# Altium project Control_Devices.PrjPcb (part 1 of 3)
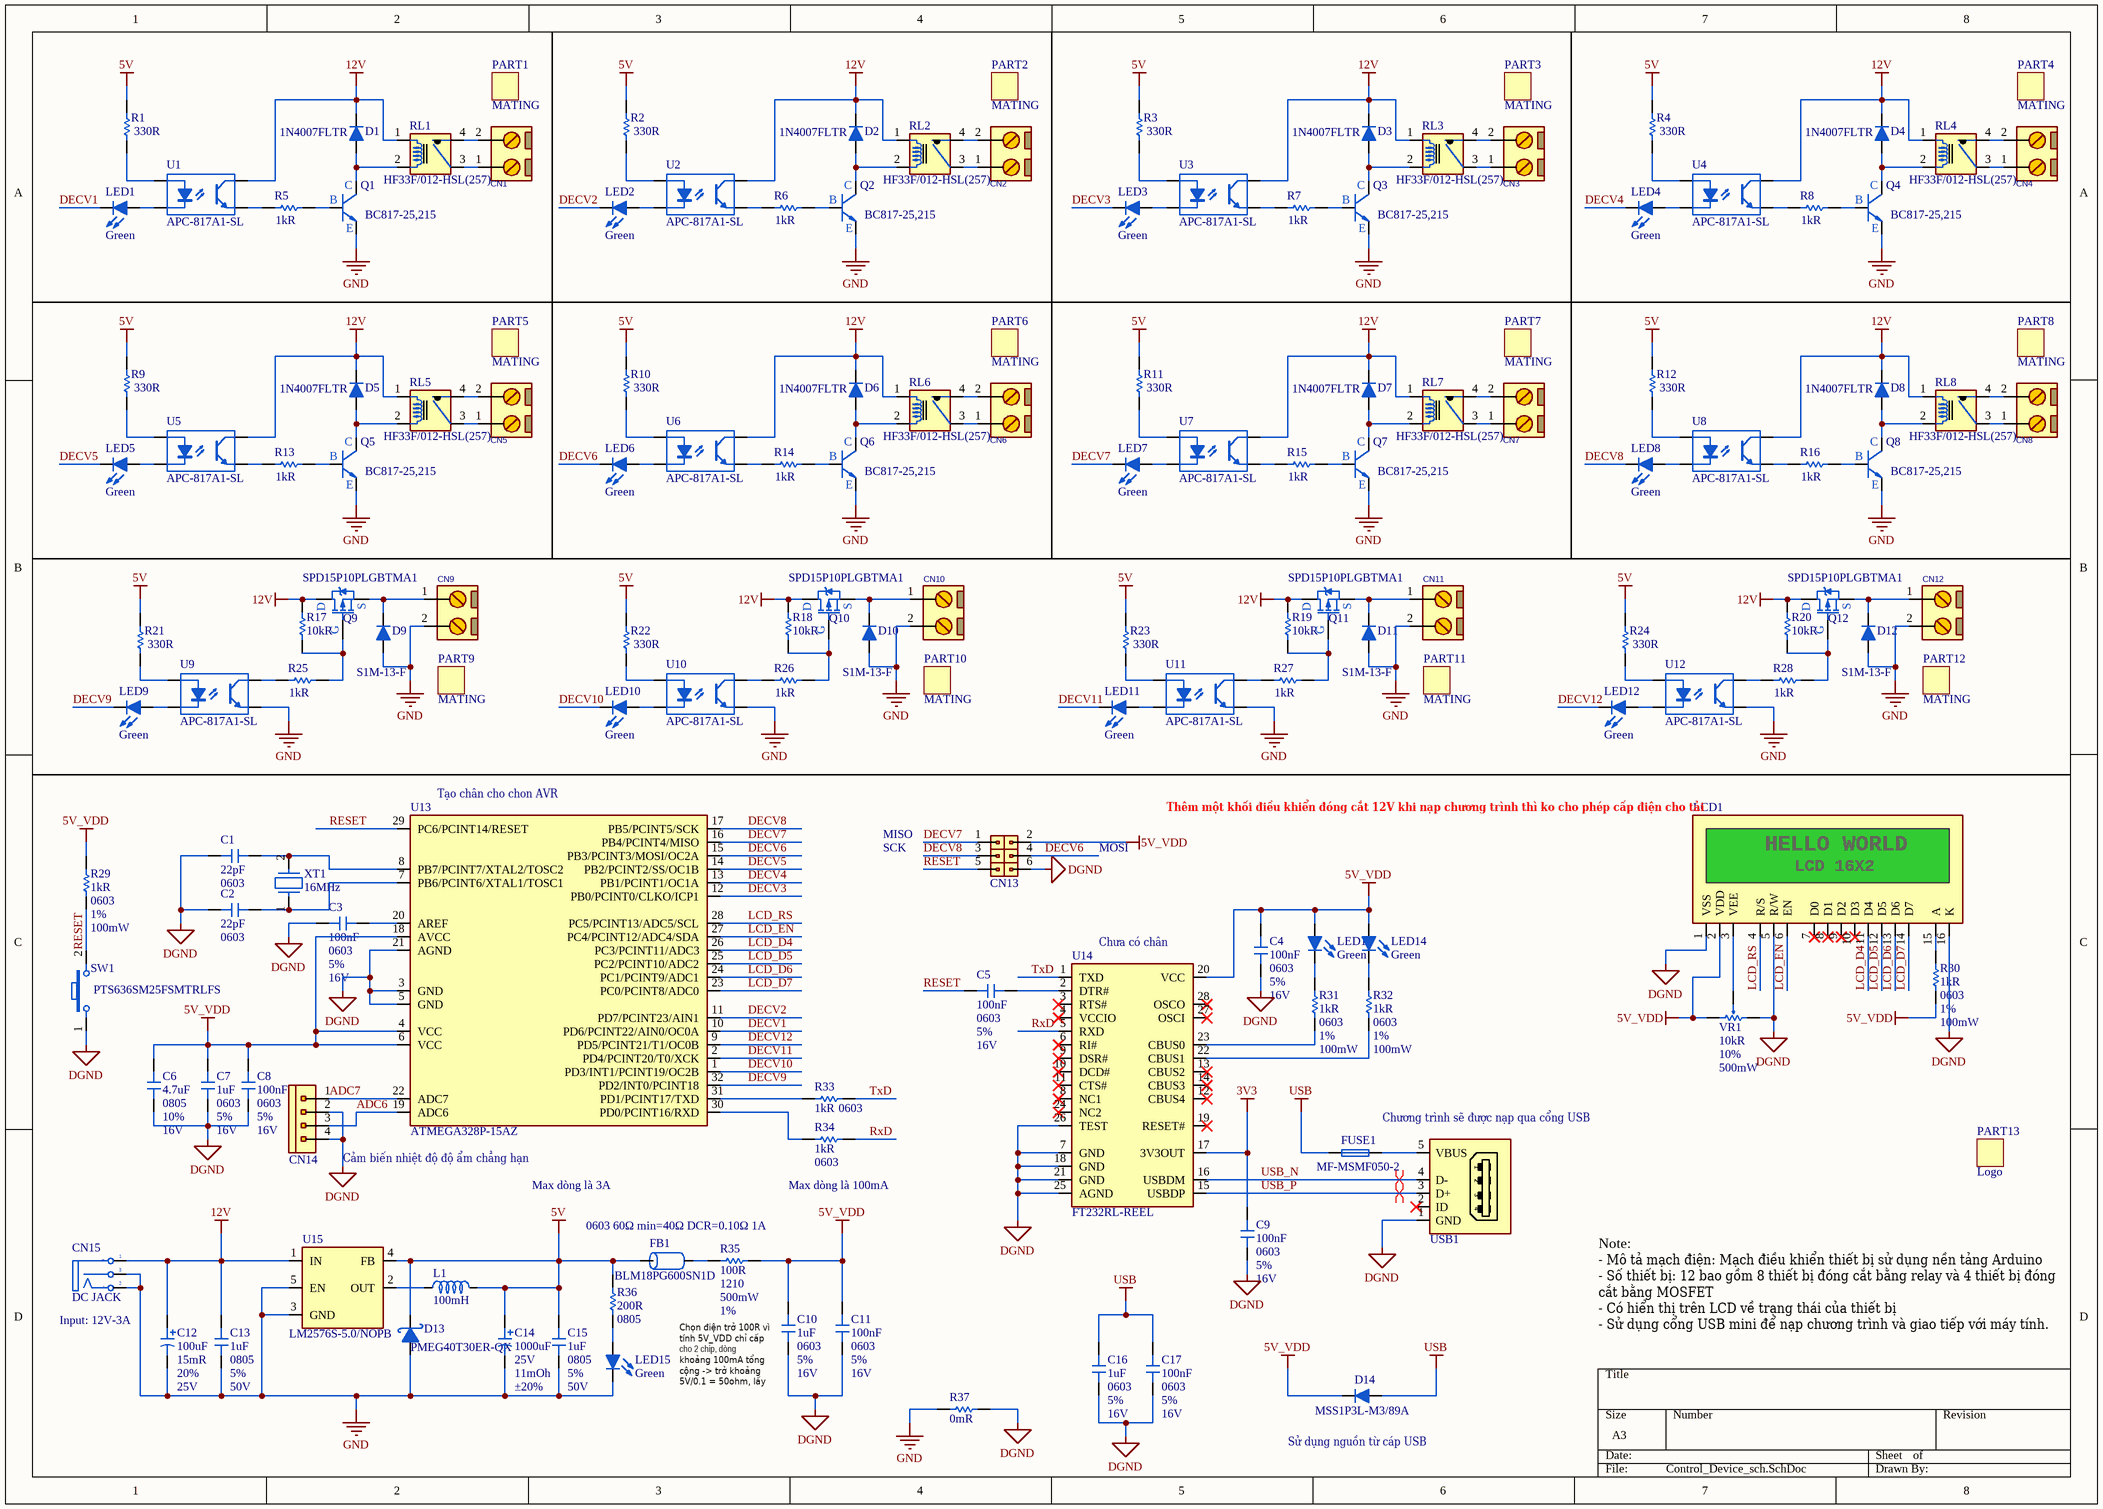
[diagram p0: Control_Device_sch.SchDoc]
1 sheet, 154 parts. Net scope: global (net labels, ports and power ports of the same name join across sheets).
Board file: Control_Device.PcbDoc

## Sheet Control_Device_sch.SchDoc
size A3

### Parts
C1  22pF  Case/Package: 0603  [C0603E]
C2  22pF  Case/Package: 0603  [C0603E]
C3  100nF  Case/Package: 0603  Tolerance: 5%  Voltage Rating: 16V  [C0603E]
C4  100nF  Case/Package: 0603  Tolerance: 5%  Voltage Rating: 16V  [C0603E]
C5  100nF  Case/Package: 0603  Tolerance: 5%  Voltage Rating: 16V  [C0603E]
C6  4.7uF  Case/Package: 0805  Tolerance: 10%  Voltage Rating: 16V  [C0603E]
C7  1uF  Case/Package: 0603  Tolerance: 5%  Voltage Rating: 16V  [C0603E]
C8  100nF  Case/Package: 0603  Tolerance: 5%  Voltage Rating: 16V  [C0603E]
C9  100nF  Case/Package: 0603  Tolerance: 5%  Voltage Rating: 16V  [C0603E]
C10  1uF  Case/Package: 0603  Tolerance: 5%  Voltage Rating: 16V  [C0603E]
C11  100nF  Case/Package: 0603  Tolerance: 5%  Voltage Rating: 16V  [C0603E]
C12  100uF  ESR (Equivalent Series Resistance): 15mR  Tolerance: 20%  Voltage Rating: 25V  [CAP_ELEC_500_12X25_THD]
C13  1uF  Case/Package: 0805  Tolerance: 5%  Voltage Rating: 50V  [C0805E]
C14  1000uF  Voltage: 25V  ERS: 11mOh  Tolerance: ±20%  [CAP_ELEC_500_10X16_THD]
C15  1uF  Case/Package: 0805  Tolerance: 5%  Voltage Rating: 50V  [C0805E]
C16  1uF  Case/Package: 0603  Tolerance: 5%  Voltage Rating: 16V  [C0603E]
C17  100nF  Case/Package: 0603  Tolerance: 5%  Voltage Rating: 16V  [C0603E]
CN1  (no value)  [CON_PWR_508_H_2P]
CN2  (no value)  [CON_PWR_508_H_2P]
CN3  (no value)  [CON_PWR_508_H_2P]
CN4  (no value)  [CON_PWR_508_H_2P]
CN5  (no value)  [CON_PWR_508_H_2P]
CN6  (no value)  [CON_PWR_508_H_2P]
CN7  (no value)  [CON_PWR_508_H_2P]
CN8  (no value)  [CON_PWR_508_H_2P]
CN9  (no value)  [CON_PWR_508_H_2P]
CN10  (no value)  [CON_PWR_508_H_2P]
CN11  (no value)  [CON_PWR_508_H_2P]
CN12  (no value)  [CON_PWR_508_H_2P]
CN13  PEC03DAAN  [CON_JPR_254_M_2X3]  (value not drawn)
CN14  (no value)  [CON_JPR_254_M_1X4]
CN15  DC JACK  [JAC_DC_2MM_THD]
D1  1N4007FLTR  [D1206_SOD123_DO213AA]
D2  1N4007FLTR  [D1206_SOD123_DO213AA]
D3  1N4007FLTR  [D1206_SOD123_DO213AA]
D4  1N4007FLTR  [D1206_SOD123_DO213AA]
D5  1N4007FLTR  [D1206_SOD123_DO213AA]
D6  1N4007FLTR  [D1206_SOD123_DO213AA]
D7  1N4007FLTR  [D1206_SOD123_DO213AA]
D8  1N4007FLTR  [D1206_SOD123_DO213AA]
D9  S1M-13-F  [DIODE_SMA]
D10  S1M-13-F  [DIODE_SMA]
D11  S1M-13-F  [DIODE_SMA]
D12  S1M-13-F  [DIODE_SMA]
D13  PMEG40T30ER-QX  [DIODE_SOD123W]
D14  MSS1P3L-M3/89A  [DIODE_S457]
FB1  BLM18PG600SN1D  [IND_L0603E_1608]
FUSE1  MF-MSMF050-2  [RFUSE]
L1  100mH  [L_12X12]
LCD1  (no value)  [LCD_16x2]
LED1  Green  [LED0603]
LED2  Green  [LED0603]
LED3  Green  [LED0603]
LED4  Green  [LED0603]
LED5  Green  [LED0603]
LED6  Green  [LED0603]
LED7  Green  [LED0603]
LED8  Green  [LED0603]
LED9  Green  [LED0603]
LED10  Green  [LED0603]
LED11  Green  [LED0603]
LED12  Green  [LED0603]
LED13  Green  [LED0603]
LED14  Green  [LED0603]
LED15  Green  [LED0603]
PART1  MATING  (no BOM)
PART2  MATING  (no BOM)
PART3  MATING  (no BOM)
PART4  MATING  (no BOM)
PART5  MATING  (no BOM)
PART6  MATING  (no BOM)
PART7  MATING  (no BOM)
PART8  MATING  (no BOM)
PART9  MATING  (no BOM)
PART10  MATING  (no BOM)
PART11  MATING  (no BOM)
PART12  MATING  (no BOM)
PART13  Logo  [MyLogo_5mm - Invert]  (no BOM)
Q1  BC817-25,215  [SOT23_3]
Q2  BC817-25,215  [SOT23_3]
Q3  BC817-25,215  [SOT23_3]
Q4  BC817-25,215  [SOT23_3]
Q5  BC817-25,215  [SOT23_3]
Q6  BC817-25,215  [SOT23_3]
Q7  BC817-25,215  [SOT23_3]
Q8  BC817-25,215  [SOT23_3]
Q9  SPD15P10PLGBTMA1  [DPAK3_TO-252]
Q10  SPD15P10PLGBTMA1  [DPAK3_TO-252]
Q11  SPD15P10PLGBTMA1  [DPAK3_TO-252]
Q12  SPD15P10PLGBTMA1  [DPAK3_TO-252]
R1  330R  [R0603E]
R2  330R  [R0603E]
R3  330R  [R0603E]
R4  330R  [R0603E]
R5  1kR  [R0603E]
R6  1kR  [R0603E]
R7  1kR  [R0603E]
R8  1kR  [R0603E]
R9  330R  [R0603E]
R10  330R  [R0603E]
R11  330R  [R0603E]
R12  330R  [R0603E]
R13  1kR  [R0603E]
R14  1kR  [R0603E]
R15  1kR  [R0603E]
R16  1kR  [R0603E]
R17  10kR  [R0603E]
R18  10kR  [R0603E]
R19  10kR  [R0603E]
R20  10kR  [R0603E]
R21  330R  [R0603E]
R22  330R  [R0603E]
R23  330R  [R0603E]
R24  330R  [R0603E]
R25  1kR  [R0603E]
R26  1kR  [R0603E]
R27  1kR  [R0603E]
R28  1kR  [R0603E]
R29  1kR  Case/Package: 0603  Tolerance: 1%  Max Power Dissipation: 100mW  [R0603E]
R30  1kR  Case/Package: 0603  Tolerance: 1%  Max Power Dissipation: 100mW  [R0603E]
R31  1kR  Case/Package: 0603  Tolerance: 1%  Max Power Dissipation: 100mW  [R0603E]
R32  1kR  Case/Package: 0603  Tolerance: 1%  Max Power Dissipation: 100mW  [R0603E]
R33  1kR  Case/Package: 0603  [R0603E]
R34  1kR  Case/Package: 0603  [R0603E]
R35  100R  Case/Package: 1210  Power Rating: 500mW  Tolerance: 1%  [R1210]
R36  200R  Case/Package: 0805  [R0805E]
R37  0mR  [R1210]
RL1  HF33F/012-HSL(257)  [RELAY_HF33F-Form-A]
RL2  HF33F/012-HSL(257)  [RELAY_HF33F-Form-A]
RL3  HF33F/012-HSL(257)  [RELAY_HF33F-Form-A]
RL4  HF33F/012-HSL(257)  [RELAY_HF33F-Form-A]
RL5  HF33F/012-HSL(257)  [RELAY_HF33F-Form-A]
RL6  HF33F/012-HSL(257)  [RELAY_HF33F-Form-A]
RL7  HF33F/012-HSL(257)  [RELAY_HF33F-Form-A]
RL8  HF33F/012-HSL(257)  [RELAY_HF33F-Form-A]
SW1  PTS636SM25FSMTRLFS  [SW2-SMD]
U1  APC-817A1-SL  [SO_4]
U2  APC-817A1-SL  [SO_4]
U3  APC-817A1-SL  [SO_4]
U4  APC-817A1-SL  [SO_4]
U5  APC-817A1-SL  [SO_4]
U6  APC-817A1-SL  [SO_4]
U7  APC-817A1-SL  [SO_4]
U8  APC-817A1-SL  [SO_4]
U9  APC-817A1-SL  [SO_4]
U10  APC-817A1-SL  [SO_4]
U11  APC-817A1-SL  [SO_4]
U12  APC-817A1-SL  [SO_4]
U13  ATMEGA328P-15AZ  [TQFP80P900X900X120-32N]
U14  FT232RL-REEL  [SOP65P780X200-28N]
U15  LM2576S-5.0/NOPB  [D2PAK_5P]
USB1  CONN_USB_MICROB  [USB_MICRO_B_BM_SHT2]  (value not drawn)
VR1  10kR  Tolerance: 10%  Power Rating: 500mW  [POT_3362H]
XT1  16MHz  [XT_2P_THD]

### Nets
3V3: C9.2 U14.17(3V3OUT)
5V: C14.1 C15.2 D13.2(K) FB1.1 L1.2 R1.2 R2.2 R3.2 R4.2 R9.2 R10.2 R11.2 R12.2 R21.2 R22.2 R23.2 R24.2 R36.2 U15.4(FB)
5V_VDD: C4.2 C6.2 C7.2 C8.1 C10.2 C11.2 CN13.2 D14.2(K) LCD1.2(VDD) LED13.1(A) LED14.1(A) R29.2 R30.2 R35.1 U13.4(VCC) U13.6(VCC) U13.18(AVCC) U14.20(VCC) VR1.1
12V: C12.1 C13.2 CN15.1(T) D1.2(K) D2.2(K) D3.2(K) D4.2(K) D5.2(K) D6.2(K) D7.2(K) D8.2(K) Q9.2(D) Q10.2(D) Q11.2(D) Q12.2(D) R17.2 R18.2 R19.2 R20.2 RL1.1 RL2.1 RL3.1 RL4.1 RL5.1 RL6.1 RL7.1 RL8.1 U1.4(C) U2.4(C) U3.4(C) U4.4(C) U5.4(C) U6.4(C) U7.4(C) U8.4(C) U15.1(IN)
DGND: C1.2 C2.2 C3.2 C4.1 C6.1 C7.1 C8.2 C9.1 C10.1 C11.1 C16.1 C17.1 CN13.6 CN14.2 CN14.4 LCD1.1(VSS) LCD1.5(R/W) LCD1.16(K) R37.1 SW1.1 U13.3(GND) U13.5(GND) U13.21(AGND) U14.7(GND) U14.18(GND) U14.21(GND) U14.25(AGND) U14.26(TEST) USB1.1(GND) VR1.3
GND: C12.2 C13.1 C14.2 C15.1 CN9.2 CN10.2 CN11.2 CN12.2 CN15.2(TN) CN15.3(S) D9.1(A) D10.1(A) D11.1(A) D12.1(A) D13.1(A) LED15.2(K) Q1.2(E) Q2.2(E) Q3.2(E) Q4.2(E) Q5.2(E) Q6.2(E) Q7.2(E) Q8.2(E) R37.2 U9.3(E) U10.3(E) U11.3(E) U12.3(E) U15.3(GND) U15.5(EN)
USB: C16.2 C17.2 D14.1(A) FUSE1.1
ADC6: CN14.3 U13.19(ADC6)
ADC7: CN14.1 U13.22(ADC7)
DECV1: LED1.2(K) U13.10(PD6/PCINT22/AIN0/OC0A)
DECV2: LED2.2(K) U13.11(PD7/PCINT23/AIN1)
DECV3: LED3.2(K) U13.12(PB0/PCINT0/CLKO/ICP1)
DECV4: LED4.2(K) U13.13(PB1/PCINT1/OC1A)
DECV5: LED5.2(K) U13.14(PB2/PCINT2/SS/OC1B)
DECV6: CN13.4 LED6.2(K) U13.15(PB3/PCINT3/MOSI/OC2A)
DECV7: CN13.1 LED7.2(K) U13.16(PB4/PCINT4/MISO)
DECV8: CN13.3 LED8.2(K) U13.17(PB5/PCINT5/SCK)
DECV9: LED9.2(K) U13.32(PD2/INT0/PCINT18)
DECV10: LED10.2(K) U13.1(PD3/INT1/PCINT19/OC2B)
DECV11: LED11.2(K) U13.2(PD4/PCINT20/T0/XCK)
DECV12: LED12.2(K) U13.9(PD5/PCINT21/T1/OC0B)
LCD_D4: LCD1.11(D4) U13.26(PC3/PCINT11/ADC3)
LCD_D5: LCD1.12(D5) U13.25(PC2/PCINT10/ADC2)
LCD_D6: LCD1.13(D6) U13.24(PC1/PCINT9/ADC1)
LCD_D7: LCD1.14(D7) U13.23(PC0/PCINT8/ADC0)
LCD_EN: LCD1.6(EN) U13.27(PC4/PCINT12/ADC4/SDA)
LCD_RS: LCD1.4(R/S) U13.28(PC5/PCINT13/ADC5/SCL)
RESET: C5.2 CN13.5 R29.1 SW1.2 U13.29(PC6/PCINT14/RESET)
RxD: R34.1 U14.5(RXD)
TxD: R33.1 U14.1(TXD)
USB_N: U14.16(USBDM) USB1.4(D-)
USB_P: U14.15(USBDP) USB1.3(D+)
NetC1_1: C1.1 U13.8(PB7/PCINT7/XTAL2/TOSC2) XT1.2
NetC2_1: C2.1 U13.7(PB6/PCINT6/XTAL1/TOSC1) XT1.1
NetC3_1: C3.1 U13.20(AREF)
NetC5_1: C5.1 U14.2(DTR#)
NetCN1_1: CN1.1 RL1.3
NetCN1_2: CN1.2 RL1.4
NetCN2_1: CN2.1 RL2.3
NetCN2_2: CN2.2 RL2.4
NetCN3_1: CN3.1 RL3.3
NetCN3_2: CN3.2 RL3.4
NetCN4_1: CN4.1 RL4.3
NetCN4_2: CN4.2 RL4.4
NetCN5_1: CN5.1 RL5.3
NetCN5_2: CN5.2 RL5.4
NetCN6_1: CN6.1 RL6.3
NetCN6_2: CN6.2 RL6.4
NetCN7_1: CN7.1 RL7.3
NetCN7_2: CN7.2 RL7.4
NetCN8_1: CN8.1 RL8.3
NetCN8_2: CN8.2 RL8.4
NetCN9_1: CN9.1 D9.2(K) Q9.3(S)
NetCN10_1: CN10.1 D10.2(K) Q10.3(S)
NetCN11_1: CN11.1 D11.2(K) Q11.3(S)
NetCN12_1: CN12.1 D12.2(K) Q12.3(S)
NetD1_1: D1.1(A) Q1.3(C) RL1.2
NetD2_1: D2.1(A) Q2.3(C) RL2.2
NetD3_1: D3.1(A) Q3.3(C) RL3.2
NetD4_1: D4.1(A) Q4.3(C) RL4.2
NetD5_1: D5.1(A) Q5.3(C) RL5.2
NetD6_1: D6.1(A) Q6.3(C) RL6.2
NetD7_1: D7.1(A) Q7.3(C) RL7.2
NetD8_1: D8.1(A) Q8.3(C) RL8.2
NetFB1_2: FB1.2 R35.2
NetFUSE1_2: FUSE1.2 USB1.5(VBUS)
NetL1_1: L1.1 U15.2(OUT)
NetLCD1_3: LCD1.3(VEE) VR1.2
NetLCD1_15: LCD1.15(A) R30.1
NetLED1_1: LED1.1(A) U1.2(K)
NetLED2_1: LED2.1(A) U2.2(K)
NetLED3_1: LED3.1(A) U3.2(K)
NetLED4_1: LED4.1(A) U4.2(K)
NetLED5_1: LED5.1(A) U5.2(K)
NetLED6_1: LED6.1(A) U6.2(K)
NetLED7_1: LED7.1(A) U7.2(K)
NetLED8_1: LED8.1(A) U8.2(K)
NetLED9_1: LED9.1(A) U9.2(K)
NetLED10_1: LED10.1(A) U10.2(K)
NetLED11_1: LED11.1(A) U11.2(K)
NetLED12_1: LED12.1(A) U12.2(K)
NetLED13_2: LED13.2(K) R31.1
NetLED14_2: LED14.2(K) R32.1
NetLED15_1: LED15.1(A) R36.1
NetQ1_1: Q1.1(B) R5.1
NetQ2_1: Q2.1(B) R6.1
NetQ3_1: Q3.1(B) R7.1
NetQ4_1: Q4.1(B) R8.1
NetQ5_1: Q5.1(B) R13.1
NetQ6_1: Q6.1(B) R14.1
NetQ7_1: Q7.1(B) R15.1
NetQ8_1: Q8.1(B) R16.1
NetQ9_1: Q9.1(G) R17.1 R25.1
NetQ10_1: Q10.1(G) R18.1 R26.1
NetQ11_1: Q11.1(G) R19.1 R27.1
NetQ12_1: Q12.1(G) R20.1 R28.1
NetR1_1: R1.1 U1.1(A)
NetR2_1: R2.1 U2.1(A)
NetR3_1: R3.1 U3.1(A)
NetR4_1: R4.1 U4.1(A)
NetR5_2: R5.2 U1.3(E)
NetR6_2: R6.2 U2.3(E)
NetR7_2: R7.2 U3.3(E)
NetR8_2: R8.2 U4.3(E)
NetR9_1: R9.1 U5.1(A)
NetR10_1: R10.1 U6.1(A)
NetR11_1: R11.1 U7.1(A)
NetR12_1: R12.1 U8.1(A)
NetR13_2: R13.2 U5.3(E)
NetR14_2: R14.2 U6.3(E)
NetR15_2: R15.2 U7.3(E)
NetR16_2: R16.2 U8.3(E)
NetR21_1: R21.1 U9.1(A)
NetR22_1: R22.1 U10.1(A)
NetR23_1: R23.1 U11.1(A)
NetR24_1: R24.1 U12.1(A)
NetR25_2: R25.2 U9.4(C)
NetR26_2: R26.2 U10.4(C)
NetR27_2: R27.2 U11.4(C)
NetR28_2: R28.2 U12.4(C)
NetR31_2: R31.2 U14.23(CBUS0)
NetR32_2: R32.2 U14.22(CBUS1)
NetR33_2: R33.2 U13.31(PD1/PCINT17/TXD)
NetR34_2: R34.2 U13.30(PD0/PCINT16/RXD)

Not connected (* = marked no-connect by the designer): LCD1 7(D0)* 8(D1)* 9(D2)* 10(D3)*; U14 3(RTS#)* 4(VCCIO)* 6(RI#)* 8(NC1)* 9(DSR#)* 10(DCD#)* 11(CTS#)* 12(CBUS4)* 13(CBUS2)* 14(CBUS3)* 19(RESET#)* 24(NC2)* 27(OSCI)* 28(OSCO)*; USB1 2(ID)*

### Layout directives
differential pair: USB_N, USB_P

### Notes on the sheet
- (near U13) Tạo chân cho chon AVR
- SCK
- MISO
- MOSI
- Thêm một khối điều khiển đóng cắt 12V khi nạp chương trình thì ko cho phép cấp điện cho tải
- (near U14) Chưa có chân
- Chương trình sẽ được nạp qua cổng USB
- Cảm biến nhiệt độ độ ẩm chẳng hạn
- Max dòng là 3A
- (near R34) Max dòng là 100mA
- 0603 60Ω min=40Ω DCR=0.10Ω 1A
- Input: 12V-3A
- (near C10) Chọn điện trở 100R vì tính 5V_VDD chỉ cấp cho 2 chip, dòng khoảng 100mA tổng cộng -> trở khoảng 5V/0.1 = 50ohm, lấy dư gấp đôi, công suất = 5x0.1 = 0.5W
- Note:
  - Mô tả mạch điện: Mạch điều khiển thiết bị sử dụng nền tảng Arduino
  - Số thiết bị: 12 bao gồm 8 thiết bị đóng cắt bằng relay và 4 thiết bị đóng cắt bằng MOSFET
  - Có hiển thị trên LCD về trạng thái của thiết bị
  - Sử dụng cổng USB mini để nạp chương trình và giao tiếp với máy tính.
- (near D14) Sử dụng nguồn từ cáp USB
- (in symbol DC_JACK) +; -
- (in symbol LCD_16X2) HELLO WORLD; LCD 16X2